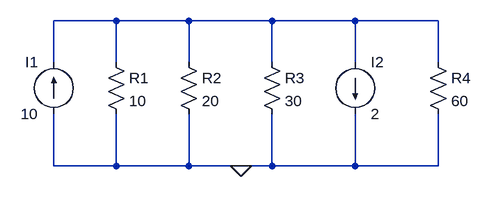
[diagram p0: schematic Draft7.asc]
Draft7.asc, the LTspice schematic file:
Version 4
SHEET 1 880 680
WIRE 144 48 48 48
WIRE 256 48 144 48
WIRE 384 48 256 48
WIRE 512 48 384 48
WIRE 640 48 512 48
WIRE 48 112 48 48
WIRE 144 112 144 48
WIRE 256 112 256 48
WIRE 384 112 384 48
WIRE 512 112 512 48
WIRE 640 112 640 48
WIRE 48 272 48 192
WIRE 144 272 144 192
WIRE 144 272 48 272
WIRE 256 272 256 192
WIRE 256 272 144 272
WIRE 336 272 256 272
WIRE 384 272 384 192
WIRE 384 272 336 272
WIRE 512 272 512 192
WIRE 512 272 384 272
WIRE 640 272 640 192
WIRE 640 272 512 272
FLAG 336 272 0
SYMBOL current 48 192 R180
WINDOW 0 24 80 Left 2
WINDOW 3 24 0 Left 2
SYMATTR InstName I1
SYMATTR Value 10
SYMBOL res 128 96 R0
SYMATTR InstName R1
SYMATTR Value 10
SYMBOL res 240 96 R0
SYMATTR InstName R2
SYMATTR Value 20
SYMBOL res 368 96 R0
SYMATTR InstName R3
SYMATTR Value 30
SYMBOL current 512 112 R0
SYMATTR InstName I2
SYMATTR Value 2
SYMBOL res 624 96 R0
SYMATTR InstName R4
SYMATTR Value 60

The netlist it stands for:
* Draft7.asc
I1 0 N001 10
R1 N001 0 10
R2 N001 0 20
R3 N001 0 30
I2 N001 0 2
R4 N001 0 60
.backanno
.end